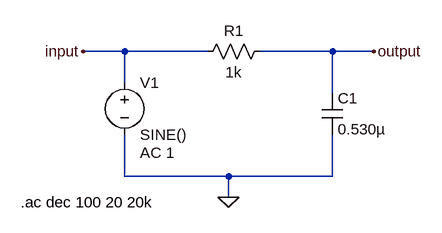
[diagram p0: schematic low-pass-filter.asc]
low-pass-filter.asc, the LTspice schematic file:
Version 4
SHEET 1 880 680
WIRE 16 96 -48 96
WIRE 144 96 16 96
WIRE 336 96 224 96
WIRE 400 96 336 96
WIRE 16 144 16 96
WIRE 336 160 336 96
WIRE 16 288 16 224
WIRE 176 288 16 288
WIRE 336 288 336 224
WIRE 336 288 176 288
WIRE 176 320 176 288
FLAG 176 320 0
FLAG -48 96 input
FLAG 400 96 output
SYMBOL voltage 16 128 R0
WINDOW 123 24 124 Left 2
WINDOW 39 0 0 Left 0
SYMATTR Value2 AC 1
SYMATTR InstName V1
SYMATTR Value SINE()
SYMBOL res 240 80 R90
WINDOW 0 0 56 VBottom 2
WINDOW 3 32 56 VTop 2
SYMATTR InstName R1
SYMATTR Value 1k
SYMBOL cap 320 160 R0
SYMATTR InstName C1
SYMATTR Value 0.530µ
TEXT -144 328 Left 2 !.ac dec 100 20 20k

The netlist it stands for:
* low-pass-filter.asc
V1 input 0 SINE() AC 1
R1 output input 1k
C1 output 0 0.530µ
.ac dec 100 20 20k
.backanno
.end